# Altium schematic sheet Volt_Meas.SchDoc
size A
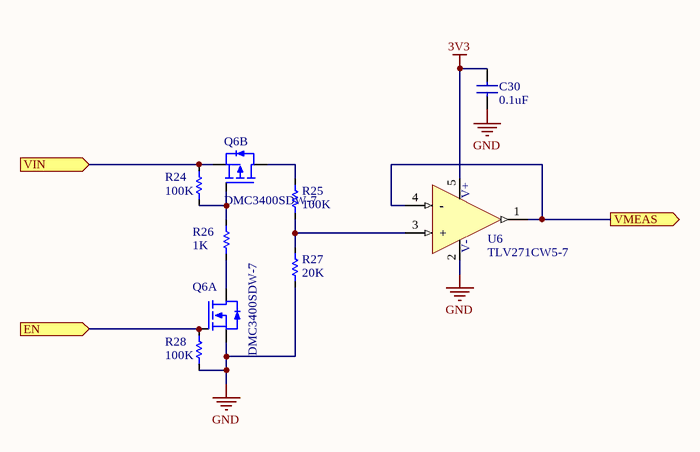
[diagram p0: Volt_Meas.SchDoc]

## Parts
C30  value 0.1uF  [0603_CAPACITOR]  (hidden comment: CAP 0.1uF 50V X7R)
Q6  DMC3400SDW-7  [SOT23-6]  (parts A,B of 2)
R24  value 100K  [0603_Resistor]  (hidden comment: R_0603_100K_1%)
R25  value 100K  [0603_Resistor]  (hidden comment: R_0603_100K_1%)
R26  value 1K  [0603_Resistor]  (hidden comment: R_0603_1K_1%)
R27  value 20K  [0603_Resistor]  (hidden comment: R_0603_20K_1%)
R28  value 100K  [0603_Resistor]  (hidden comment: R_0603_100K_1%)
U6  TLV271CW5-7  [SOT23-5]

## Ports
EN (in), VIN (in), VMEAS (out)

## Nets
3V3: C30.1 U6.5(VDD)
GND: C30.2 Q6.1(SOURCE) R27.1 R28.1 U6.2(GND)
EN: Q6.2(GATE) R28.2 ; port EN
VIN: Q6.4(SOURCE) R24.2 ; port VIN
VMEAS: U6.1(OUT) U6.4(-) ; port VMEAS
NetQ6_3: Q6.3(DRAIN) R26.1
NetQ6_5: Q6.5(GATE) R24.1 R26.2
NetQ6_6: Q6.6(DRAIN) R25.2
NetR25_1: R25.1 R27.2 U6.3(+)

## Notes on the sheet
- (in symbol U_TLV27) V+; V-

## Library data of the parts
C30 = C_0603_0.1uF_50V_10%: CAP CERM 0.1uF 10% 50V 0603; SVP Creator: Spencer Berglund; Package: =SelectedPackage; Voltage: 50V; Temperature Coefficient: X7R; Supplier 1: Digi-Key; Supplier Part Number 1: 1276-1000-1-ND
Q6 = Q_DMC3400SDW: Mosfet Array N and P-Channel 30V 650mA, 450mA 310mW Surface Mount SOT-363; Manufacturer: Diodes; Rds On Max: 400mR; Input Capacitance: 55pF; ComponentLink1URL: http://www.st.com/web/en/resource/technical/document/datasheet/CD00001894.pdf; ComponentLink1Description: http://www.st.com/web/en/resource/technical/document/datasheet/CD00001894.pdf; Supplier 1: Digi-Key; Min Operating Temperature: -55°C; Drain to Source Voltage (Vdss): 30V; Max Operating Temperature: 150°C; FET Type: N and P-Channel; Continuous Drain Current (ID): 450mA; Manufacturer Part Number: DMC3400SDW-7; Max Power Dissipation: 310mW; Supplier Part Number 1: DMC3400SDW-7DIDKR-ND
R24-R28 = R_0603_generic_1%: Generic 0603 Resistor; Manufacturer: Yageo; Power Rating: 0.1W; Temperature Coefficient: ±100ppm/°C; Tolerance: ±1%; Operating Temperature: -55°C ~ 155°C; Manufacturer Part Number: ='RC0603FR-07'+ValueFormatted+'L'; HelpURL: https://www.digikey.com/products/en/resistors/chip-resistor-surface-mount/52?pv17=103&FV=fffc000d%2Cc0001%2C1c0002%2C1f140000%2Cffe00034&k=RC0603; ValueFormatted: =Copy(Copy(Value, 0, Pos('.', Value)-1)+Copy(Value, Length(Value), 1)+Copy(Value, Pos('.', Value)+1, Length(Value)-Pos('.', Value)-1),1,Pos('.',Value)*Length(Value))+Copy(Value,1,Length(Value)*(1-Pos('.',Value)))
U6 = U_TLV27: CMOS Amplifier 1 Circuit Rail-to-Rail SOT-25; Manufacturer: Diodes; Output Current per Channel: 8mA; Power Dissipation: 220mW; Min Dual Supply Voltage: 1.35V; Operating Supply Current: 550uA; Common Mode Rejection Ratio: 65dB; Voltage Gain: 110dB; Slew Rate: 2V/µs; Input Bias Current: 1pA; Power Supply Rejection Ratio (PSRR): 70dB; Input Offset Voltage (Vos): 500uV; Unity Gain Bandwidth Product: 1.9MHz; Max Supply Voltage: 16V; Max Frequency: 10kHz; Min Supply Voltage: 2.7V; Supplier 1: Digi-Key; Supplier Part Number 1: TLV271CW5-7DIDKR-ND; Width: 1.7mm; Max Operating Temperature: 70°C; Min Operating Temperature: 0°C; Manufacturer Part Number: TLV271CW5-7; Gain Bandwidth Product: 1.9MHz